# Altium project DD_Current_Sensing.PrjPcb
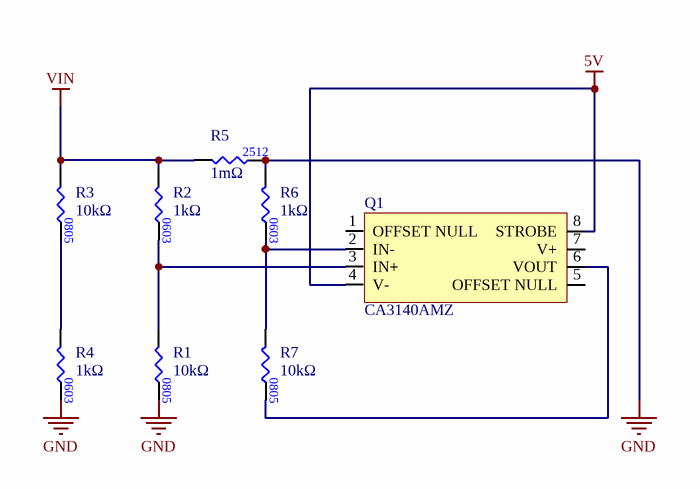
[diagram p0: Power.SchDoc]
designer: Logan Hartford; reviewer: Ari Wasch; total sheets: 6; version: 6.0
2 sheets, 9 parts. Net scope: flat (ports and power ports of the same name join across sheets).
Board file: Power.PcbDoc
Sheets:
  Power.SchDoc
  MCU.SchDoc

## Sheet Power.SchDoc: =documentname
size 279 x 215 mm; CheckedBy: TBD; Engineer: Yuchen Lin; Organization: UW Robotics; Address1: 200 University Avenue; Address2: Waterloo; Address3: Ontario; Address4: Canada N2L 3G6; DocumentNumber: 1; Revision: 1.0; SheetNumber: 1; SheetTotal: 2; designer: Yuchen Lin; reviewer: TBD; total sheets: 2; version: 1.0

### Parts
Q1  OPAMP_CA3140AMZ  [CA3140AMZ]  (value not drawn)
R1  value 10kΩ  [RES0805]  (hidden comment: RES_10kΩ_0805_5%)
R2  value 1kΩ  [RES0603]  (hidden comment: RES_1kΩ_0603_5%)
R3  value 10kΩ  [RES0805]  (hidden comment: RES_10kΩ_0805_5%)
R4  value 1kΩ  [RES0603]  (hidden comment: RES_1kΩ_0603_5%)
R5  value 1mΩ  [RESC6532X75N]  (hidden comment: RES_1mΩ_2512_1%)
R6  value 1kΩ  [RES0603]  (hidden comment: RES_1kΩ_0603_5%)
R7  value 10kΩ  [RES0805]  (hidden comment: RES_10kΩ_0805_5%)

### Nets
5V: Q1.4(V-) Q1.8(STROBE)
GND: R1.2 R4.2 R5.2 R6.1
VIN: R2.1 R3.1 R5.1
NetQ1_2: Q1.2(IN-) R6.2 R7.1
NetQ1_3: Q1.3(IN+) R1.1 R2.2
NetQ1_6: Q1.6(VOUT) R7.2
NetR3_2: R3.2 R4.1

Not connected (* = marked no-connect by the designer): Q1 1(OFFSET_NULL) 5(OFFSET_NULL) 7(V+)

### Notes on the sheet
- University of Waterloo Robotics Team
- 200 University Ave W
- REV
- PROJECT
- Waterloo, Ontario, Canada
- N2L 3G1
- DOCUMENT
- ENGINEER
- REVIEWER
- MODIFIED
- SHEET
- OF

### Library data of the parts
Q1 = OPAMP_CA3140AMZ: IC OPAMP GP 1 CIRCUIT 8SOIC; Manufacturer 1: Renesas Electronics America Inc.; Supplier Part Number 1: CA3140AMZ-ND; Supplier 1: Digi-Key; Manufacturer Part Number 1: CA3140AMZ
R1 R3 R7 = RES_10kΩ_0805_5%: RES 10K OHM 5% 1/8W 0805; Manufacturer 1: Panasonic Electronic Components; Manufacturer Part Number 1: ERJ-6GEYJ103V; Package/Footprint: 0805; Supplier 1: Digi-Key; Supplier Part Number 1: P10KACT-ND; LCSC Part #: C17414; Mounting Type: SMD
R2 R4 R6 = RES_1kΩ_0603_5%: RES 1K OHM 5% 1/10W 0603; Manufacturer 1: Yageo; Manufacturer Part Number 1: RC0603JR-071KL; Supplier Part Number 1: 311-1.0KGRCT-ND; Supplier 1: Digi-Key; Mounting Type: SMD; Package: 0603
R5 = RES_1mΩ_2512_1%: RES 1 mOHM 1% 3W 2512; Manufacturer 1: Riedon; Manufacturer Part Number 1: CSRL3-0R001F8; Supplier 1: Digi-Key; Supplier Part Number 1: 696-1834-1-ND; Mounting Type: SMD; Package: 2512

## Sheet MCU.SchDoc: MCU.SchDoc
size 279 x 215 mm
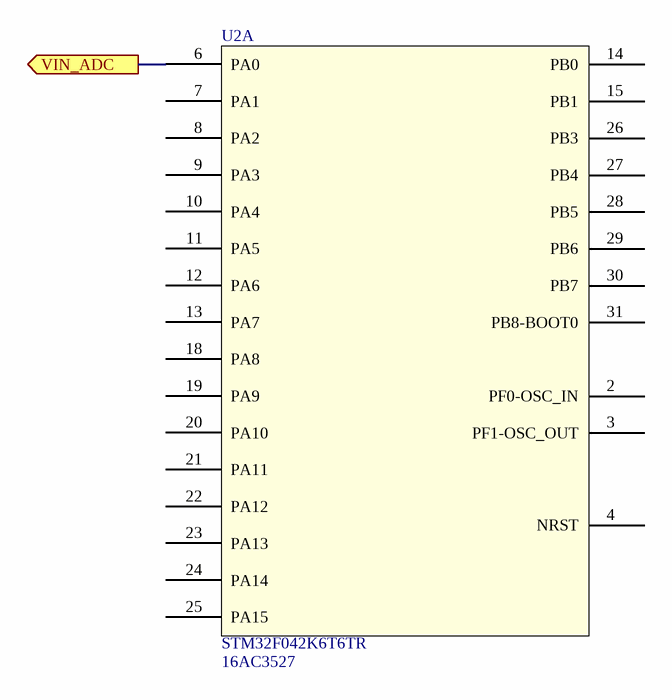
[diagram p1: MCU.SchDoc]

### Parts
U2  STM32F042K6T6TR  Supplier Part Number 1: 16AC3527  [LQFP-32]  (part A of 2)

### Ports
VIN_ADC (out)

### Nets
NetU2_6: U2.6(PA0) ; port VIN_ADC

Not connected (* = marked no-connect by the designer): U2 2(PF0-OSC_IN) 3(PF1-OSC_OUT) 4(NRST) 7(PA1) 8(PA2) 9(PA3) 10(PA4) 11(PA5) 12(PA6) 13(PA7) 14(PB0) 15(PB1) 18(PA8) 19(PA9) 20(PA10) 21(PA11) 22(PA12) 23(PA13) 24(PA14) 25(PA15) 26(PB3) 27(PB4) 28(PB5) 29(PB6) 30(PB7) 31(PB8-BOOT0)

### Notes on the sheet
- University of Waterloo Robotics Team
- 200 University Ave W
- REV
- PROJECT
- Waterloo, Ontario, Canada
- N2L 3G1
- DOCUMENT
- ENGINEER
- REVIEWER
- MODIFIED
- SHEET
- OF

### Library data of the parts
U2 = STM32F042K6T6TR: ARM® Cortex®-M0 STM32F0 Microcontroller IC 32-Bit Single-Core 48MHz 32KB (32K x 8) FLASH 32-LQFP (7x7); Mfr_Name: STMicroelectronics; Voltage - Supply (Vcc/Vdd): 2V ~ 3.6V; Core Processor: ARM® Cortex®-M0; Core Size: 32-Bit Single-Core; Speed: 48MHz; Program Memory Size: 32KB (32K x 8); Operating Temperature: -40°C ~ 85°C (TA); Package / Case: 32-LQFP; ComponentLink1Description: digikey; ComponentLink1URL: https://www.digikey.com/en/products/detail/stmicroelectronics/STM32F042K6T6TR/10414582; Supplier 1: Avnet

## Assembly variants
Only Populated Components: all parts fitted